# Altium schematic sheet PSU.SchDoc: POWER SUPPLY 220VAC 5V-3.3V
size A4; Author: Rachid AKKOUCHE; CompanyName: RASoftware; DrawnBy: Rachid AKKOUCHE; Engineer: Rachid AKKOUCHE; Organization: RASoftware; Address1: 2, rue Geroges MELIES; Address2: 78390 BOIS D'ARCY; Address3: FRANCE; DocumentNumber: BRA20210209_3; SheetNumber: 3; SheetTotal: 4; Dessinepar: Rachid AKKOUCHE; Property: RASoftware; ProjectName: Projet BRA
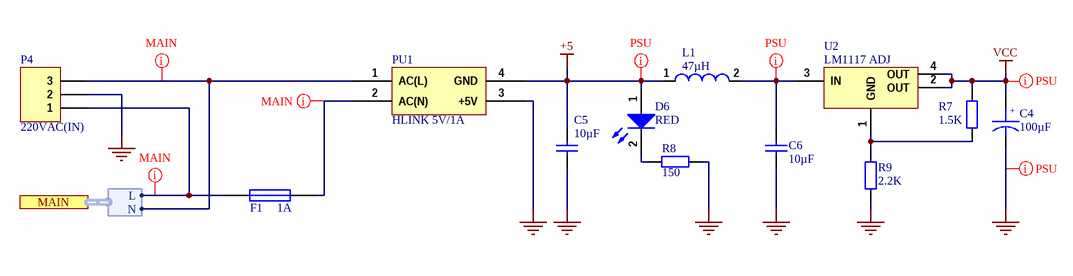
[diagram p0: PSU.SchDoc]

## Parts
C4  100µF  [KEMET_4 - 3]
C5  10µF  [C 0805(2012)x0.65]
C6  10µF  [C 0805(2012)x0.65]
D6  RED  [0603-LEDR]
F1  1A  [FUS5X20]
L1  47µH  [SELF4.5X4X3.2]
P4  220VAC(IN)  [CO3P508 - 2]
PU1  HLINK 5V/1A  [H-LINK]
R7  1.5K  [R 0805(2012)]
R8  150  [R 0805(2012)]
R9  2.2K  [R 0805(2012)]
U2  LM1117 ADJ  [SOT223]

## Ports
MAIN (harness MAIN)

## Harnesses
MAIN: L, N

## Nets
+5: C5.1 D6.1(A) L1.1 PU1.4(GND)
GND: C4.2 C5.2 C6.2 P4.2 PU1.3(+5V) R8.1 R9.1
VCC: C4.1 R7.2 U2.2(OUT) U2.4(OUT)
NetC6_1: C6.1 L1.2 U2.3(IN)
NetD6_2: D6.2(K) R8.2
NetF1_1: F1.1 P4.1 ; port MAIN.L
NetF1_2: F1.2 PU1.2(AC(N))
NetP4_3: P4.3 PU1.1(AC(L)) ; port MAIN.N
NetR7_1: R7.1 R9.2 U2.1(GND)

## Layout directives
rule Width Constraint [Pref Width = 20mil    Min Width = 10mil    Max Width = 50mil]: +5, GND, NetC6_1, VCC
rule Width Constraint [Pref Width = 50mil    Min Width = 10mil    Max Width = 100mil]: NetF1_1, NetF1_2, NetP4_3

## Notes on the sheet
- Project:
- Il ne peut être divulgué sans l'accord écrit de l'un de ses représentants dûment mandaté
- Ce document est la propriété de
- Title:
- Number:
- Date:
- Time:
- Size:
- A4
- Revision:
- Sheet
- of
- 2, rue Georges MELIES
- Draw by:
- 78390 BOIS D'ARCY
- (in symbol Cap Pol 100µF - 16) +

## Library data of the parts
C4 = Cap Pol 100µF - 16: SMD Polarized Capacitor 16V; Manufacturer: EPCOS; Manufacturer Part Number: B41142A4107M; Product Range: EPCOS - B41142 Series; Capacité: 100; Tolérance de capacité: ± 20%; Tension: 16; Type de boîtier de condensateur: Radial Can - SMD; Diamètre: 6.3; Résistance, ESR: 0.16; Hauteur: 7.7; Courant d'ondulation c.a.: 300; Type de packaging: Cut Tape; Durée de vie @ température: 2000 heures @ 105; Température d'utilisation min: -55; Température de fonctionnement max..: 105; SVHC: No SVHC (19-Dec-2012); Impédance: 0.26; Température de fonctionnement: -55°C à +105; Température, ESR: 20; Type de boîtier: CMS; Supplier 1: Farnell; RoHS: YES; Pricing 1: 10=0,123, 50=0,095, 100=0,078, 250=0,07, 1000=0,062 (EUR); Courant d'ondulation c.a. à  100Hz: 300; Fréquence, impédance: 100; Longueur/hauteur: 7.7; Température, courant ondulatoire: 105; Température, impédance: 20; ComponentLink1URL: http://www.epcos.com/inf/20/30/db/alu_x/B41142.pdf; ComponentLink1Description: http://www.epcos.com/inf/20/30/db/alu_x/B41142.pdf; Supplier Part Number 1: 1735328
C5 C6 = Cap 0805 10µF: Capacitor non polarized 10µF SMD 0805; Capacitance: 10uF; Dielectric: X7R; Tolerance: 10%; Voltage: 16V; ComponentLink1URL: http://www.tme.eu/en/details/cc0805kkx5r5106/0805-mlcc-smd-capacitors/yageo/cc0805kkx5r5bb106/; ComponentLink1Description: http://www.tme.eu/en/details/cc0805kkx5r5106/0805-mlcc-smd-capacitors/yageo/cc0805kkx5r5bb106/; Case Code (Imperial): 0805; Case Code (Metric): 2012; Case/Package: 0805; Depth: 1.25mm; Height: 1.25mm; Lead Free: Lead Free; Length: 2mm; Max Operating Temperature: 85°C; Min Operating Temperature: -55°C; Mount: Surface Mount; Package Quantity: 1; Packaging: Tape and Reel; Radiation Hardening: No; Thickness: 0.055inch; Voltage Rating: 16V; Voltage Rating (DC): 16V; Width: 0.049inch; Supplier 1: TME; Supplier Part Number 1: CL21A106KOQNNNE
D6 = HSMH-C190: Surface Mount Chip LED, Red; Manufacturer: AVAGO TECHNOLOGIES; Manufacturer Part Number: HSMH-C190.; Taille de lampe: 0.8mm x 1; Couleur de LED: Rouge; Intensité lumineuse: 17; Angle, vision: 170°; Courant, direct, If: 20; Tension, direct à  If: 1.8; Montage LED: CMS; Forme de lentille: Rectangulaire; Longueur d'onde typ.: 626; SVHC: No SVHC (19-Dec-2012); Dissipation de puissance: 65; Intensité lumineuse min. à  If: 2.8; Intensité lumineuse typique: 10; Largeur (externe): 0.8; Longueur d'onde dominante: 639; Longueur d'onde, crête: 630; Longueur/hauteur: 1.6; Matière: AlGaAs; Nombre de broches: 2; Orientation de montage opto: Dessus; Orientation sortie de lumière: Top Emitting; Température de fonctionnement: -30°C à +85; Température de fonctionnement max..: 85; Température, stockage min.: -40; Température d'utilisation min: -30; Tension, Vf max..: 2.6; Tension, Vf min.: 2.1; Type de LED: Standard; Supplier 1: Farnell; Supplier Part Number 1: 8554641; RoHS: YES; Pricing 1: 5=0,06, 25=0,059, 100=0,057, 250=0,052, 500=0,047 (EUR); MSL: MSL 2A - 4 semaines; Couleur, LED: Rouge; Profondeur: 0.8; Température, stockage max..: 85; Tension, Vf typ.: 1.8; ComponentLink1URL: http://www.farnell.com/datasheets/313031.pdf; ComponentLink1Description: http://www.farnell.com/datasheets/313031.pdf; ComponentLink2URL: http://www.farnell.com/datasheets/55927.pdf; ComponentLink2Description: http://www.farnell.com/datasheets/55927.pdf; Couleur: RED
F1 = Fuse holder SMD 5X20: Fuse holder 5x20 SMD; Manufacturer: LITTELFUSE WICKMANN; Manufacturer Part Number: 65800001009; Voltage Rating VDC: 250; Fuse Current: 10; Fuse Holder Type: Cartridge Fuse Holder; Holder Terminals: Solder Lug; No. of Fuses: 1; Fuse Size Held: 5mm x 20; Supplier 1: Farnell; RoHS: YES; Pricing 1: 1=1,39, 10=1,31, 100=1,25, 250=1,19, 500=1,12, 1000=1,05 (EUR); Voltage Rating VAC: 250; Supplier Part Number 1: 1716677
L1 = SELF: Manufacturer: COILCRAFT; Manufacturer Part Number: DO3316P-473MLD; Product Range: DO3316; Inductance: 47; RMS Current (Irms): 1.8; Saturation Current (Isat): 1.6; Inductor Construction: Unshielded; DC Resistance Max: 0.14; Power Inductor Case: 12.95mm x 9.4mm x 5.21; Inductance Tolerance: ± 20%; SVHC: No SVHC (12-Jan-2017); Self Resonant Frequency Min: 12MHz<!--FANDB--><div class="features-and-benefits-container"><div class="features-and-benefits-description"><span class="features-benefits-value">The DO3316P-473MLD is a surface mount unshielded Power Inductor with ferrite core. This inductor features gold over nickel over phosphor bronze terminations and is resistance to soldering heat maximum three 40 seconds reflows at +260°C, parts cooled to room temperature between cycles. This inductor also features moisture sensitivity level (MSL) of 1, failures in time (FIT)/mean time between failures (MTBF) is 38 per billion hours/26,315,789 hours, calculated per Telcordia SR-332 and only pure water or alcohol recommended for wash. Current at 25°C causes an inductance drop of 10% typical from its value without current. ±20; Supplier 1: Farnell; Supplier Part Number 1: 2287252; RoHS: YES; Stock 1: 2601; Pricing 1: 1=0.981, 500=0.722 (GBP); Packaging: Cut Tape; ComponentLink1URL: http://www.farnell.com/datasheets/1681904.pdf; ComponentLink1Description: http://www.farnell.com/datasheets/1681904.pdf
P4 = Header 3: Header, 3-Pin; Manufacturer: TE CONNECTIVITY / BUCHANAN; Manufacturer Part Number: 796636-3; LatestRevisionDate: 17-Jul-2002; LatestRevisionNote: Re-released for DXP Platform.; Publisher: Altium Limited; Supplier 1: Farnell; Supplier Part Number 1: 2059780; RoHS: YES; Pricing 1: 10=0,68, 100=0,51, 500=0,43, 1000=0,36, 2000=0,35, 5000=0,33 (EUR); ComponentLink1URL: http://www.farnell.com/cad/1652960.pdf; ComponentLink1Description: http://www.farnell.com/cad/1652960.pdf; ComponentLink2URL: http://www.farnell.com/datasheets/1650926.pdf; ComponentLink2Description: http://www.farnell.com/datasheets/1650926.pdf
PU1 = H-LINK  5: POWER SUPPLY 5V 1A
R7 = Resistor 0805 1.5K: Resistor SMD 0805 1.5K; Power Rating: 125mW; Resistance: 1.5kR; Temperature Coefficient: 100ppm/°C; Tolerance: 1%; Voltage Rating: 150V; Case Code (Imperial): 0805; Case Code (Metric): 2012; Case/Package: 0805; Composition: Thick Film; Mount: Surface Mount; Packaging: Tape and Reel; REACH SVHC: Unknown; Voltage Rating (DC): 150V; Supplier 1: Farnell; Supplier Part Number 1: 2446909; VALUE: 1.5K
R8 = Resistor 0805 150: Resistor SMD 0805 150; Manufacturer: YAGEO; Manufacturer Part Number: RC0805JR-07150KL; Unit: pcs; SuppliedAmount: 0; MinAmount: 100; Resistance: 150kΩ; Power: 0.125W; Tolerance: ±5%; Max. operating voltage: 150V; Max. overload voltage: 300V; Supplier 1: TME; Category: 0805 SMD Resistors; Stock 1: 6800; Pricing 1: 100=0.00566, 1000=0.0034, 5000=0.00111, 15000=0.00102, 50000=0.00088 (EUR); Weight: 0.028; Multiples: 100; Resistor type: thick film; Mounting: SMD; Case: 0805; Operating temperature: -55...155°C; Price Type: NET; ComponentLink1URL: http://static.tme.eu/products_pics/6/6/c/66cc5cd64257edd80ca8e9fd2040972d/56038.jpg; ComponentLink1Description: http://static.tme.eu/products_pics/6/6/c/66cc5cd64257edd80ca8e9fd2040972d/56038.jpg; Supplier Part Number 1: RC0805JR-07150K
R9 = Resistor 0805 2.2K: Resistor SMD 0805 2.2K; Manufacturer: BOURNS; Manufacturer Part Number: CR0805-FX-2201ELF; Supplier 1: Farnell; RoHS: YES; Stock 1: 2028; Pricing 1: 10=0.035, 100=0.0233, 500=0.0162, 1000=0.0141, 2500=0.012, 5000=0.0105, 25000=0.0065 (GBP); ComponentLink1URL: http://www.bourns.com/engineering/CHPREZTR/cr0805.stp; ComponentLink1Description: http://www.bourns.com/engineering/CHPREZTR/cr0805.stp; ComponentLink2URL: http://www.farnell.com/datasheets/2178762.pdf; ComponentLink2Description: http://www.farnell.com/datasheets/2178762.pdf; Supplier Part Number 1: 2333585
U2 = LM1117DT-ADJ: 800mA Adjustable low-Dropout Linear Regulator, 3-pin TO-252; ComponentLink1URL: http://www.ti.com/lit/ds/symlink/tlv1117.pdf; ComponentLink1Description: http://www.ti.com/lit/ds/symlink/tlv1117.pdf; ComponentLink2URL: http://www.farnell.com/cad/1614300.zip; ComponentLink2Description: http://www.farnell.com/cad/1614300.zip